# EasyEDA Pro project ChargeDischargeSwitchingCircuit.eprj

# Schematic Schematic1
Board Name: Board1; Create Date: 2025-08-28; Page Name: P1; Project Name: SwitchingCircuit; Schematic Name: Schematic1; Update Date: 2025-08-28; Company: EasyEDA.com; Page Size: A4; Version: V1.0
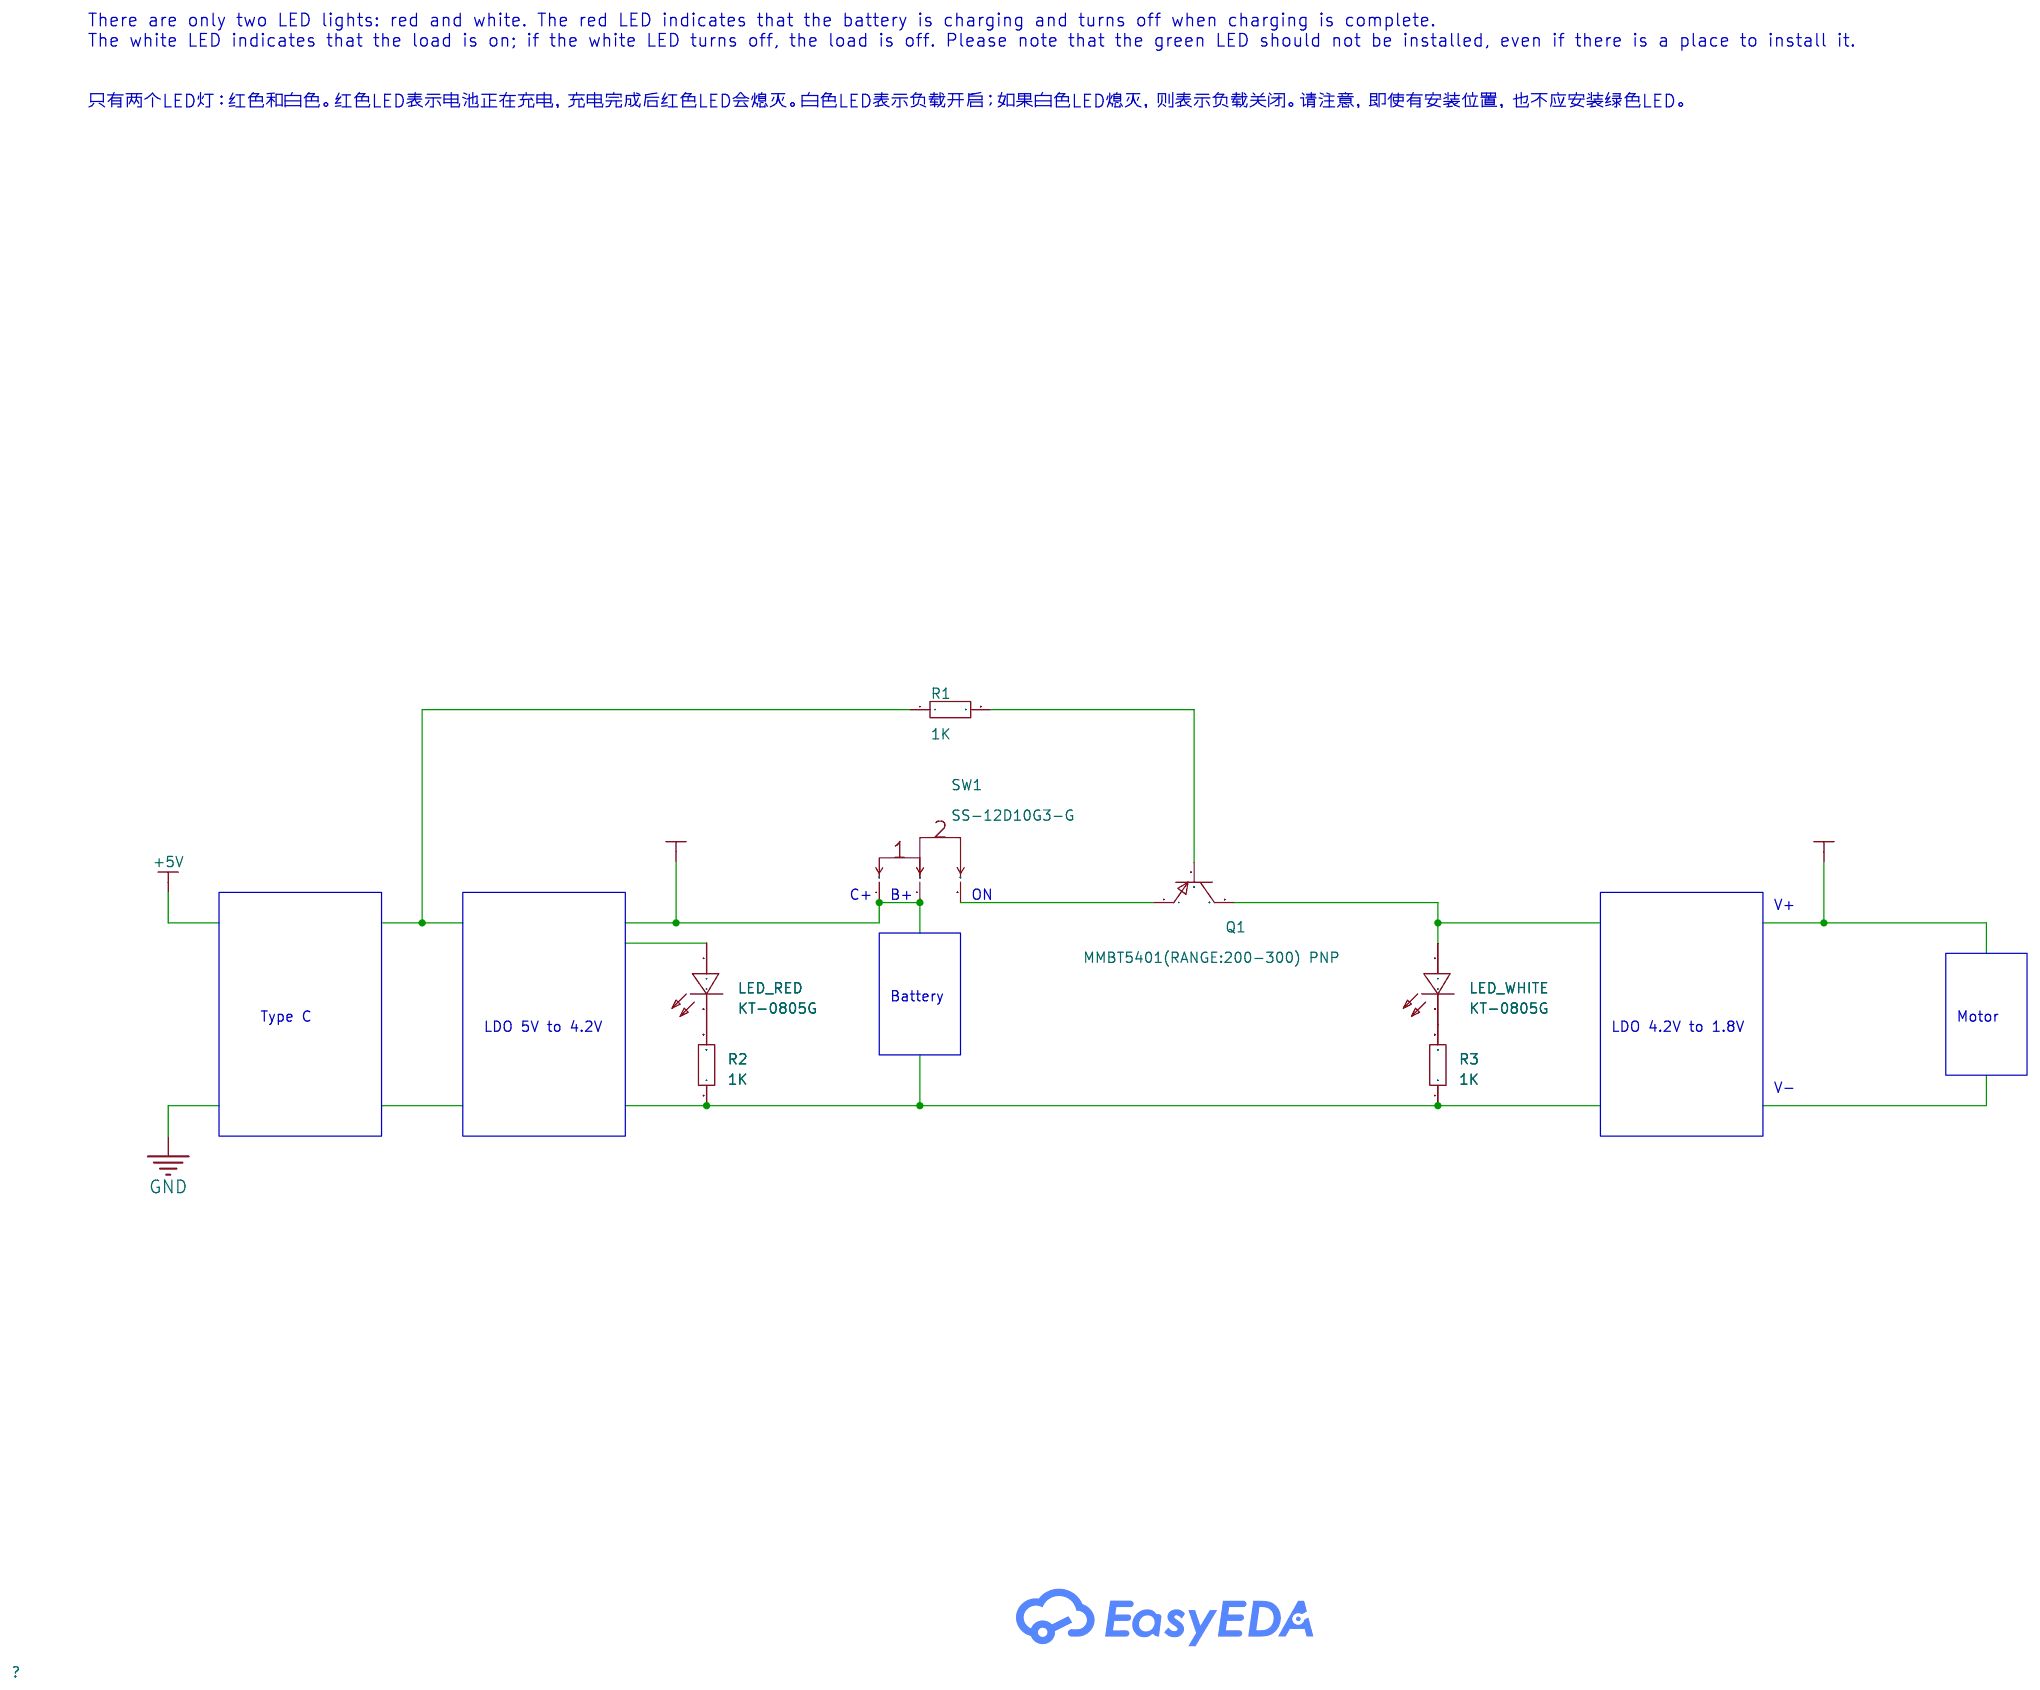
[diagram p0: schematic sheet]

## Parts
LED_RED  KT-0805G  [LED0805-R-RD]
LED_WHITE  KT-0805G  [LED0805-R-RD]
Q1  MMBT5401(RANGE:200-300) PNP  [SOT-23-3_L2.9-W1.3-P1.90-LS2.4-BR]
R1  1K  [R0603]
R2  1K  [R0603]
R3  1K  [R0603]
SW1  SS-12D10G3-G  [SW-TH_3P-L12.7-W6.7-P4.80_SS-12D10G10-G]

## Library data of the parts
LED_RED LED_WHITE = KT-0805G: Lamp Holder Type:- Emitted Color:Emerald Forward Voltage (VF):- Forward Voltage (VF):- Power Dissipation:- Forward Current:- Dominant Wavelength:- Dominant Wavelength:- Peak Wavelength:- Diode Configuration:- Lens Color:- Color Temperature:- Color Tempera; LCSC Part Name: 0805 翠绿 高亮; Supplier Part: C2297; Manufacturer: KENTO; Supplier Footprint: 0805; JLCPCB Part Class: Basic Part; Datasheet: https://atta.szlcsc.com/upload/public/pdf/source/20170209/1486607340485.pdf; Supplier: LCSC; Emitted Color: Emerald
Q1 = MMBT5401(RANGE:200-300): type:PNP Current - Collector(Ic):600mA Collector - Emitter Voltage VCEO:150V Pd - Power Dissipation:300mW DC Current Gain:- DC Current Gain:- Transition frequency(fT):100MHz Current - Collector Cutoff:100nA Vce Saturation(VCE(sat)):500mV Operating Tempera; LCSC Part Name: hfe=200~300 PNP 电流:0.6A 电压:150V; Supplier Part: C8326; Manufacturer: CJ(江苏长电/长晶); Supplier Footprint: SOT-23; JLCPCB Part Class: Basic Part; Datasheet: https://item.szlcsc.com/datasheet/MMBT5401(RANGE%253A200-300)/8818.html; Supplier: LCSC; type: PNP; Current - Collector(Ic): 600mA; Collector - Emitter Voltage VCEO: 150V; Pd - Power Dissipation: 300mW; Transition frequency(fT): 100MHz; Current - Collector Cutoff: 100nA; Vce Saturation(VCE(sat)): 500mV; Operating Temperature: -55℃~+150℃
R1-R3 = Res_0603: Supplier Footprint: 0603
SW1 = SS-12D10G3-G: LCSC Part Name: 拨动开关,立式直脚两档,插件,单排正拨,柄长3mm; Supplier Part: C49284729; Manufacturer: XUNPU(讯普); Supplier Footprint: 插件; JLCPCB Part Class: Extended Part; Datasheet: https://item.szlcsc.com/datasheet/SS-12D10G3-G/51736278.html; Supplier: LCSC

## Nets
+4.2V: SW1.1 SW1.2
Net-(LED_RED-2): LED_RED.2(K) R2.2
Net-(LED_WHITE-1): LED_WHITE.1(A) Q1.3(C)
Net-(LED_WHITE-2): LED_WHITE.2(K) R3.2
Net-(Q1-1): Q1.1(B) R1.2
Net-(Q1-2): Q1.2(E) SW1.3
Net-(R2-1): R2.1 R3.1

Not connected (* = marked no-connect by the designer): LED_RED 1(A); R1 1

## Notes on the sheet
- There are only two LED lights: red and white. The red LED indicates that the battery is charging and turns off when charging is complete.
  The white LED indicates that the load is on; if the white LED turns off, the load is off. Please note that the green LED should not be installed, even if there is a place to install it.
  只有两个LED灯：红色和白色。红色LED表示电池正在充电，充电完成后红色LED会熄灭。白色LED表示负载开启；如果白色LED熄灭，则表示负载关闭。请注意，即使有安装位置，也不应安装绿色LED。
- C+
- B+
- ON
- V+
- Battery
- Type C
- Motor
- LDO 5V to 4.2V
- LDO 4.2V to 1.8V
- V-
